# EAGLE design BLMtestpcb (EAGLE 9.4.2)
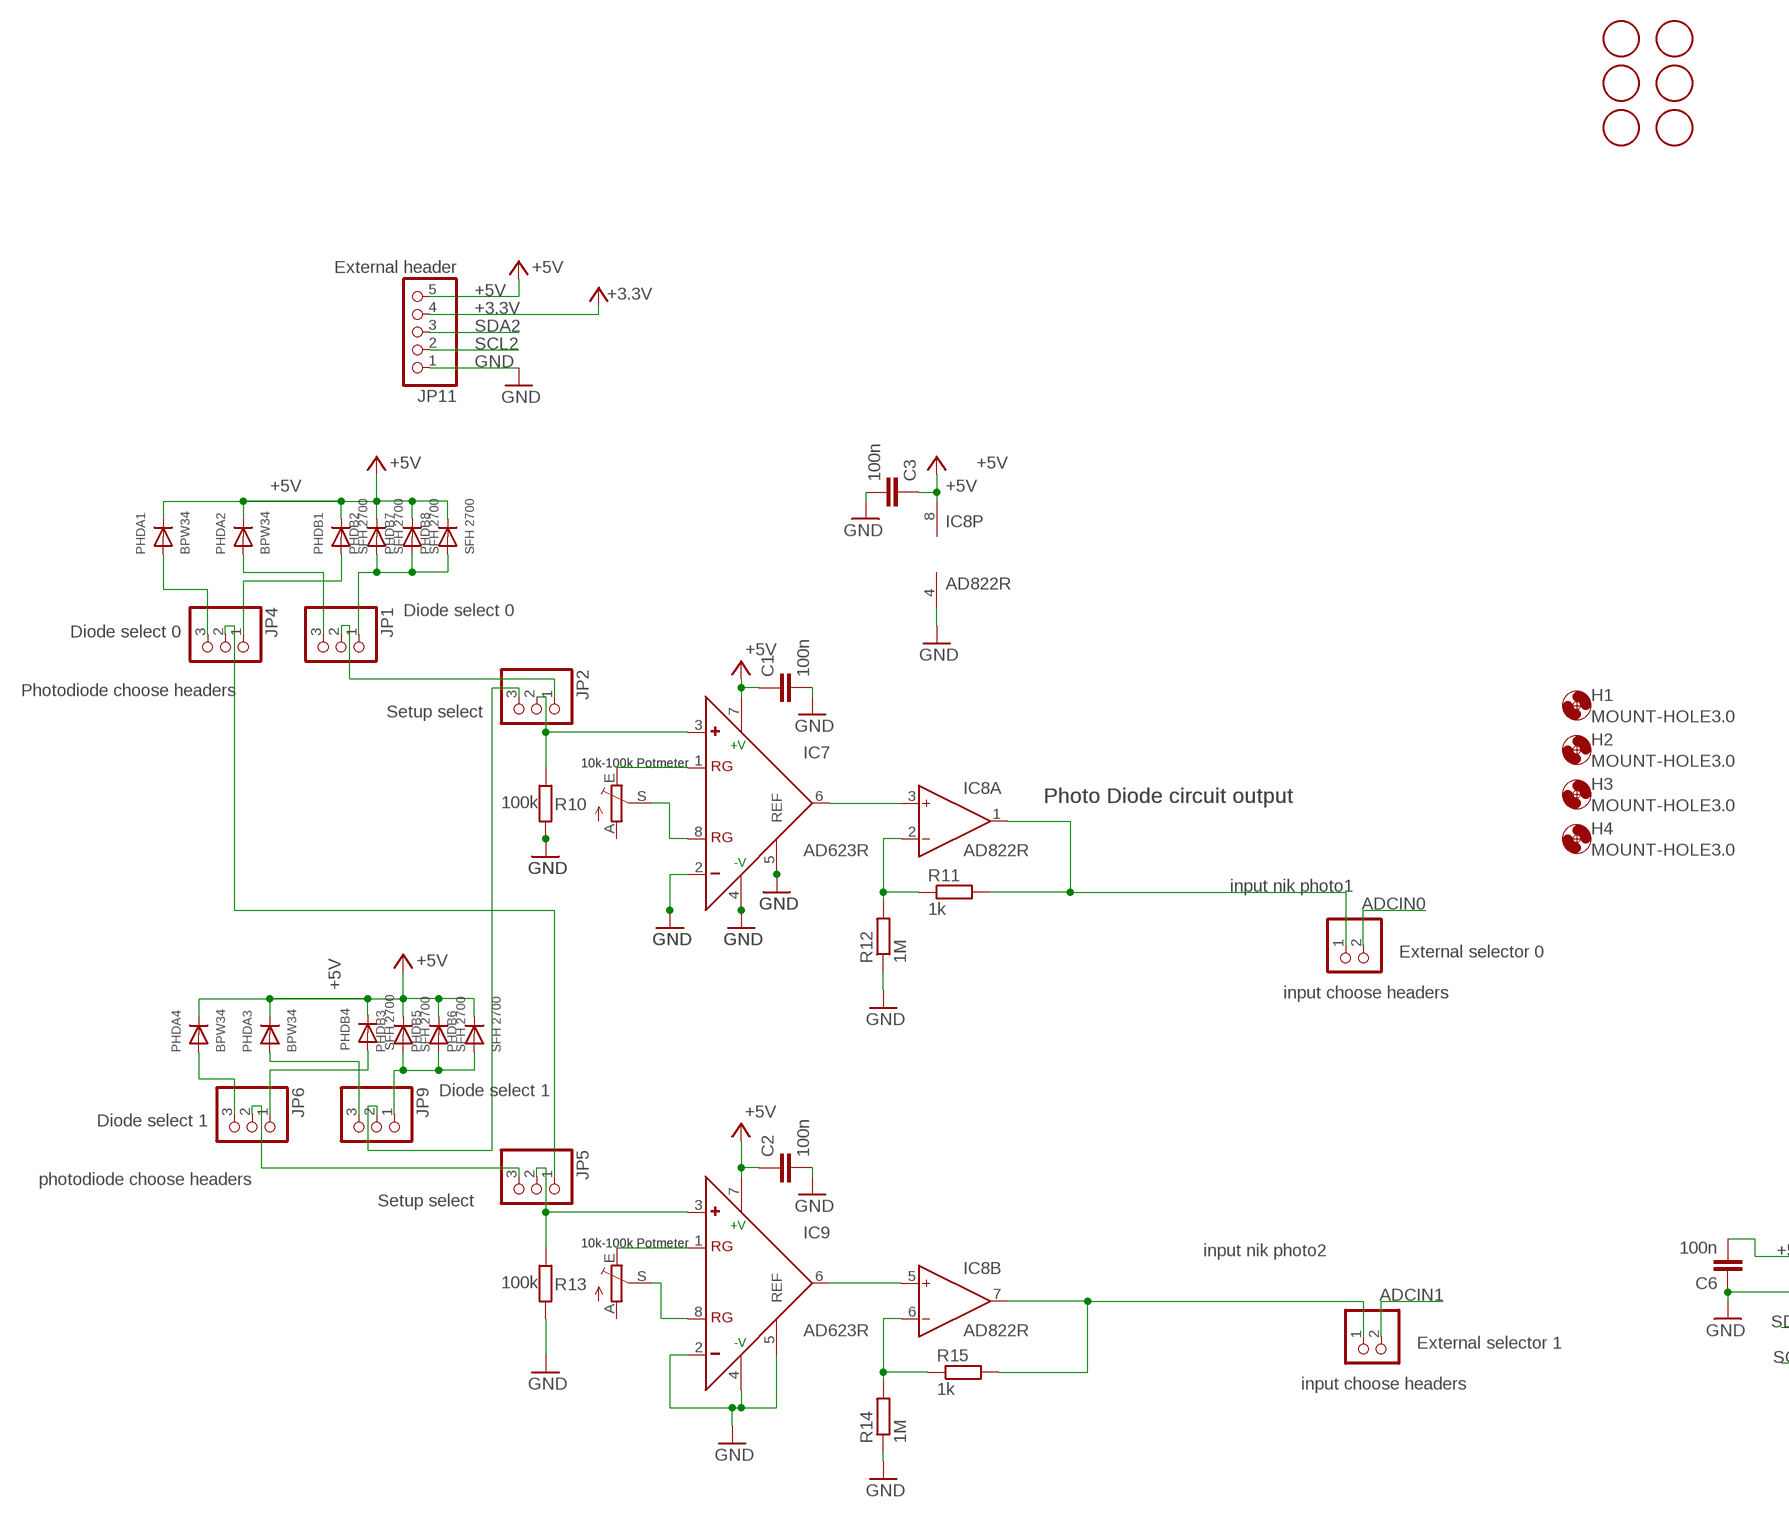
[diagram p0: schematic, sheet 1, part 1 of 2]
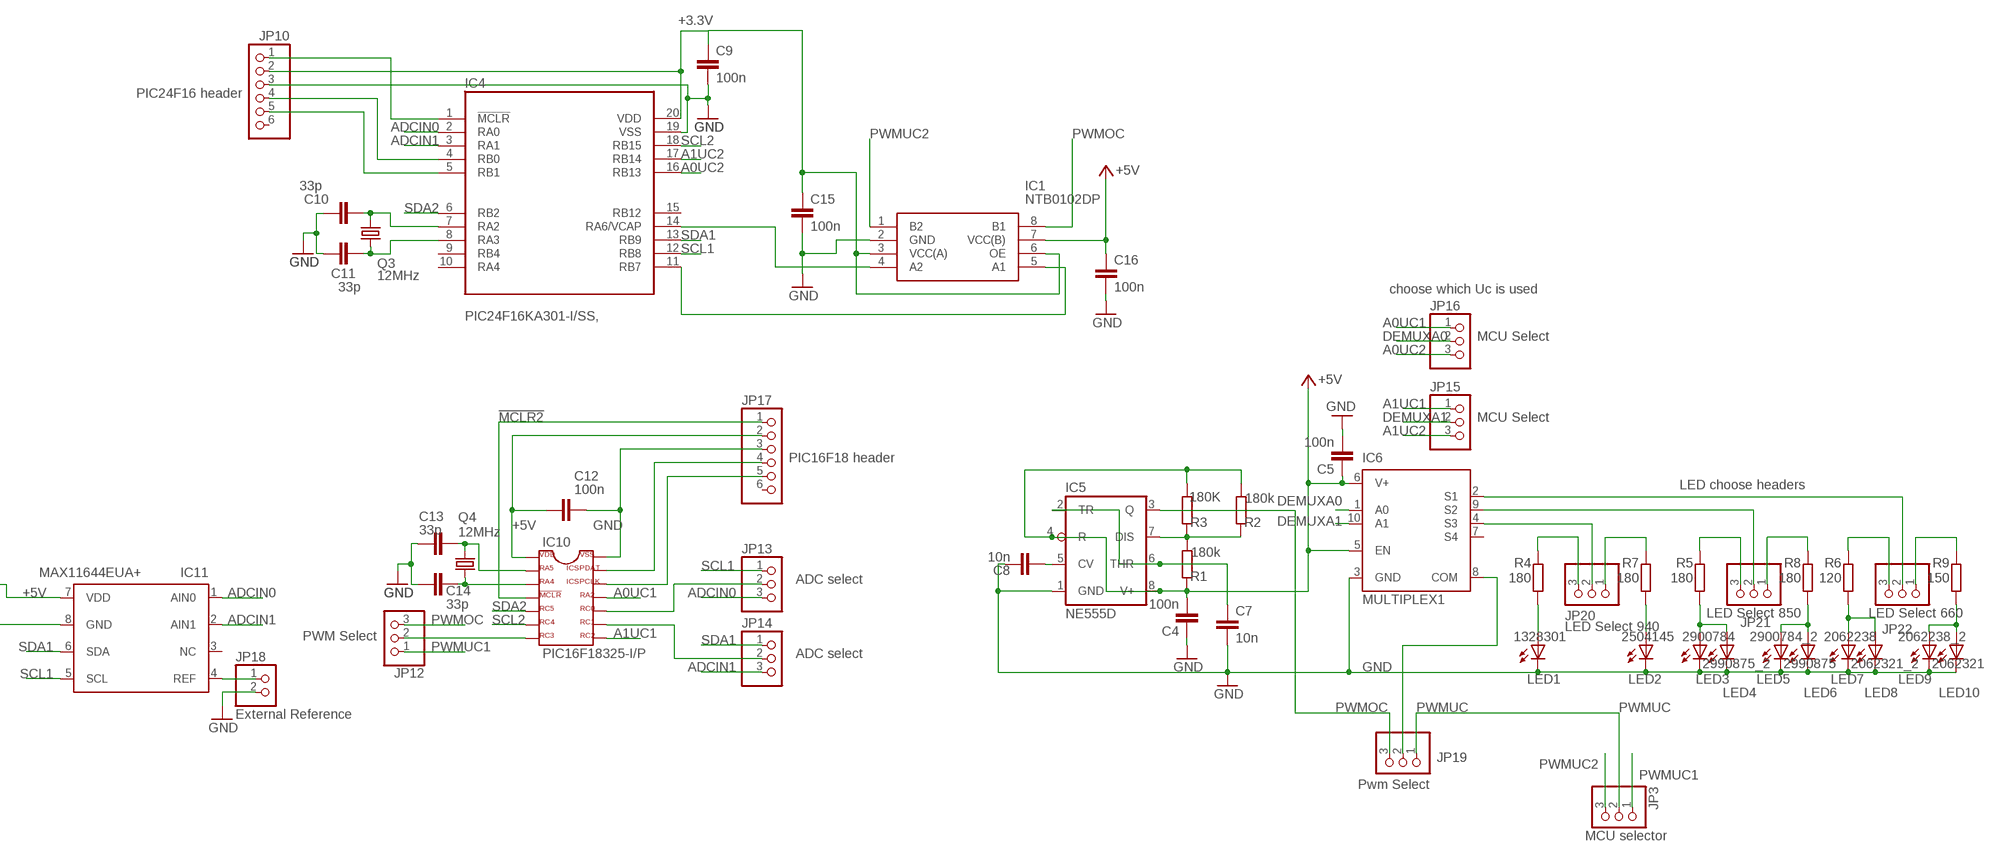
[diagram p1: schematic, sheet 1, part 2 of 2]

## Parts
C1  100n  C-EU025-025X050  [C025-025X050]
C2  100n  C-EU025-025X050  [C025-025X050]
C3  100n  C-EU025-025X050  [C025-025X050]
C4  100n  C-EU025-025X050  [C025-025X050]
C5  100n  C-EU025-025X050  [C025-025X050]
C6  100n  C-EU025-025X050  [C025-025X050]
C7  10n  C-EU025-025X050  [C025-025X050]
C8  10n  C-EU025-025X050  [C025-025X050]
C9  100n  C-EU025-024X044  [C025-024X044]
C10  33p  C-EU025-025X050  [C025-025X050]
C11  33p  C-EU025-025X050  [C025-025X050]
C12  100n  C-EU025-024X044  [C025-024X044]
C13  33p  C-EU025-025X050  [C025-025X050]
C14  33p  C-EU025-025X050  [C025-025X050]
C15  100n  C-EU025-024X044  [C025-024X044]
C16  100n  C-EU025-024X044  [C025-024X044]
H1  MOUNT-HOLE3.0  [3,0]
H2  MOUNT-HOLE3.0  [3,0]
H3  MOUNT-HOLE3.0  [3,0]
H4  MOUNT-HOLE3.0  [3,0]
IC1  NTB0102DP  [SOP65P400X110-8N]
IC4  PIC24F16KA301-I/SS,  PIC24F16KA301-I/SS  [WM8804]
IC5  NE555D  [SO08]
IC6  MULTIPLEX1  [MSOP10]
IC7  AD623R  [SO8]
IC8  AD822R  [SO8]
IC9  AD623R  [SO8]
IC10  PIC16F18325-I/P  [DIL14]
IC11  MAX11644EUA+  [UMAX8]
JP1  Diode select 0  PINHD-1X3  [1X03]
JP2  Setup select  PINHD-1X3  [1X03]
JP3  MCU selector  PINHD-1X3  [1X03]
JP4  Diode select 0  PINHD-1X3  [1X03]
JP5  Setup select  PINHD-1X3  [1X03]
JP6  Diode select 1  PINHD-1X3  [1X03]
JP7  External selector 0  PINHD-1X2  [1X02]
JP8  External selector 1  PINHD-1X2  [1X02]
JP9  Diode select 1  PINHD-1X3  [1X03]
JP10  PIC24F16 header  PINHD-1X6  [1X06]
JP11  External header  PINHD-1X5  [1X05]
JP12  PWM Select  PINHD-1X3  [1X03]
JP13  ADC select  PINHD-1X3  [1X03]
JP14  ADC select  PINHD-1X3  [1X03]
JP15  MCU Select  PINHD-1X3  [1X03]
JP16  MCU Select  PINHD-1X3  [1X03]
JP17  PIC16F18 header  PINHD-1X6  [1X06]
JP18  External Reference  PINHD-1X2  [1X02]
JP19  Pwm Select  PINHD-1X3  [1X03]
JP20  LED Select 940  PINHD-1X3  [1X03]
JP21  LED Select 850  PINHD-1X3  [1X03]
JP22  LED Select 660  PINHD-1X3  [1X03]
LED1  1328301  LEDCHIPLED_1206  [CHIPLED_1206]
LED2  2504145  LEDCHIPLED_1206  [CHIPLED_1206]
LED3  2900784  LEDCHIPLED_0603  [CHIPLED_0603]
LED4  2990875_2  LEDCHIPLED_1206  [CHIPLED_1206]
LED5  2900784_2  LEDCHIPLED_0603  [CHIPLED_0603]
LED6  2990875  LEDCHIPLED_1206  [CHIPLED_1206]
LED7  2062238  LEDCHIPLED_0805  [CHIPLED_0805]
LED8  2062321_2  LEDCHIPLED_1206  [CHIPLED_1206]
LED9  2062238_2  LEDCHIPLED_0805  [CHIPLED_0805]
LED10  2062321  LEDCHIPLED_1206  [CHIPLED_1206]
PHDA1  BPW34  DIODESOT23_WAVE  [SOT23-W]
PHDA2  BPW34  DIODESOT23_WAVE  [SOT23-W]
PHDA3  BPW34  DIODESOT23_WAVE  [SOT23-W]
PHDA4  BPW34  DIODESOT23_WAVE  [SOT23-W]
PHDB1  SFH 2700  DIODE_SOD-123FL  [SOD-123FL]
PHDB2  SFH 2700  DIODE_SOD-123FL  [SOD-123FL]
PHDB3  SFH 2700  DIODE_SOD-123FL  [SOD-123FL]
PHDB4  SFH 2700  DIODE_SOD-123FL  [SOD-123FL]
PHDB5  SFH 2700  DIODE_SOD-123FL  [SOD-123FL]
PHDB6  SFH 2700  DIODE_SOD-123FL  [SOD-123FL]
PHDB7  SFH 2700  DIODE_SOD-123FL  [SOD-123FL]
PHDB8  SFH 2700  DIODE_SOD-123FL  [SOD-123FL]
POTMETER1  10k-100k  TRIM_EU-PT10  [PT-10]
POTMETER2  10k-100k  TRIM_EU-PT10  [PT-10]
Q3  12MHz  CRYSTALHC49U70  [HC49U70]
Q4  12MHz  CRYSTALHC49U70  [HC49U70]
R1  180k  R-EU_0207/10  [0207/10]
R2  180k  R-EU_0207/10  [0207/10]
R3  180K  R-EU_0207/10  [0207/10]
R4  180  R-EU_0207/10  [0207/10]
R5  180  R-EU_0207/10  [0207/10]
R6  120  R-EU_0207/10  [0207/10]
R7  180  R-EU_0207/10  [0207/10]
R8  180  R-EU_0207/10  [0207/10]
R9  150  R-EU_0207/10  [0207/10]
R10  100k  R-EU_0207/10  [0207/10]
R11  1k  R-EU_0207/10  [0207/10]
R12  1M  R-EU_0207/10  [0207/10]
R13  100k  R-EU_0207/10  [0207/10]
R14  1M  R-EU_0207/10  [0207/10]
R15  1k  R-EU_0207/10  [0207/10]
U$1  FIDUCIAL  [FIDUCIAL_1MM]
U$2  FIDUCIAL  [FIDUCIAL_1MM]
U$3  FIDUCIAL  [FIDUCIAL_1MM]
U$4  FIDUCIAL  [FIDUCIAL_1MM]
U$5  FIDUCIAL  [FIDUCIAL_1MM]
U$6  FIDUCIAL  [FIDUCIAL_1MM]

## Nets
660A: JP22.3 R6.2
660B: JP22.1 R9.2
850A: JP21.3 R5.2
850B: JP21.1 R8.2
940A: JP20.3 R4.2
940B: JP20.1 R7.2
!MCLR: IC4.1(!MCLR) JP10.1
!MCLR2: IC10.4(VPP/!MCLR/RA3) JP17.1
+3.3V: C9.1 C15.1 IC1.3(VCC(A)) IC1.6(OE) IC4.20(VDD) JP10.2 JP11.4
+5V: C1.1 C2.1 C3.1 C4.2 C5.1 C6.2 C12.1 IC5.4(R) IC5.8(V+) IC6.5(EN) IC6.6(V+) IC7.7(+V) IC8.8(P:V+) IC9.7(+V) IC10.1(VDD) IC11.7(VDD) JP11.5 JP17.2 PHDA1.3(C) PHDA2.3(C) PHDA3.3(C) PHDA4.3(C) PHDB1.C PHDB2.C PHDB3.C PHDB4.C PHDB5.C PHDB6.C PHDB7.C PHDB8.C R1.1 R2.2 R3.2
A0UC1: IC10.11(RA2) JP16.1
A0UC2: IC4.16(RB13) JP16.3
A1UC1: IC10.8(RC2) JP15.1
A1UC2: IC4.17(RB14) JP15.3
ADCIN0: IC4.2(RA0) IC11.1(AIN0) JP7.2 JP13.3
ADCIN1: IC4.3(RA1) IC11.2(AIN1) JP8.2 JP14.3
BOT0: JP2.3 JP9.2
BOT1: JP5.3 JP6.2
DEMUXA0: IC6.1(A0) JP16.2
DEMUXA1: IC6.10(A1) JP15.2
GND: C1.2 C2.2 C3.2 C4.1 C5.2 C6.1 C7.2 C8.1 C9.2 C10.1 C11.1 C12.2 C13.1 C14.1 C15.2 C16.2 IC1.2(GND) IC4.19(VSS) IC5.1(GND) IC6.3(GND) IC7.2(-) IC7.4(-V) IC7.5(REF) IC8.4(P:V-) IC9.2(-) IC9.4(-V) IC9.5(REF) IC10.14(VSS) IC11.8(GND) JP10.3 JP11.1 JP17.3 JP18.2 LED1.C LED2.C LED3.C LED4.C LED5.C LED6.C LED7.C LED8.C LED9.C LED10.C R10.2 R12.1 R13.2 R14.1
INPUTPHOTO1: IC8.1(A:OUT) JP7.1 R11.2
N$6: IC8.6(B:IN-) R14.2 R15.1
N$7: IC1.4(A2) IC4.14(RA6/VCAP)
N$8: IC1.5(A1) IC4.11(RB7)
N$14: C7.1 IC5.2(TR) IC5.6(THR)
N$15: IC5.7(DIS) R1.2 R2.1 R3.1
N$16: IC6.8(COM) JP19.2
N$17: C8.2 IC5.5(CV)
N$18: LED1.A R4.1
N$19: LED3.A LED4.A R5.1
N$20: LED7.A LED8.A R6.1
N$21: LED2.A R7.1
N$22: LED5.A LED6.A R8.1
N$23: LED9.A LED10.A R9.1
N$24: IC6.2(S1) JP22.2
N$25: IC6.9(S2) JP21.2
N$26: IC6.4(S3) JP20.2
N$33: IC7.1(RG) POTMETER2.E
N$34: IC9.1(RG) POTMETER1.E
N$36: IC7.6(OUT) IC8.3(A:IN+)
N$37: IC8.2(A:IN-) R11.1 R12.2
N$39: IC9.8(RG) POTMETER1.S
N$42: IC8.5(B:IN+) IC9.6(OUT)
N$44: IC8.7(B:OUT) JP8.1 R15.2
N$45: IC7.8(RG) POTMETER2.S
N$50: IC10.13(RA0/ICSPDAT) JP17.4
N$51: IC4.5(RB1) JP10.5
N$52: IC4.4(RB0) JP10.4
N$56: IC10.12(RA1/ICSPCLK) JP17.5
N$57: C10.2 IC4.7(RA2) Q3.2
N$58: C11.2 IC4.8(RA3) Q3.1
N$59: IC10.7(RC3) JP12.2
N$60: C14.2 IC10.3(RA4) Q4.1
N$61: C13.2 IC10.2(RA5) Q4.2
OP-AMP0: IC7.3(+) JP2.2 R10.1
OP-AMP1: IC9.3(+) JP5.2 R13.1
PWMOC: IC1.8(B1) IC5.3(Q) JP12.3 JP19.3
PWMUC: JP3.2 JP19.1
PWMUC1: JP3.1 JP12.1
PWMUC2: IC1.1(B2) JP3.3
RC2: IC10.10(RC0) JP13.2
RC3: IC10.9(RC1) JP14.2
REF: IC11.4(REF) JP18.1
SCL1: IC4.12(RB8) IC11.5(SCL) JP13.1
SCL2: IC4.18(RB15) IC10.6(RC4) JP11.2
SDA1: IC4.13(RB9) IC11.6(SDA) JP14.1
SDA2: IC4.6(RB2) IC10.5(RC5) JP11.3
TOP0: JP1.2 JP2.1
TOP1: JP4.2 JP5.1
TYPE00A: JP4.3 PHDA1.1(A) PHDA1.2(A)
TYPE00B: JP4.1 PHDB1.A
TYPE01A: JP1.3 PHDA2.1(A) PHDA2.2(A)
TYPE01B: JP1.1 PHDB2.A PHDB7.A PHDB8.A
TYPE10A: JP6.3 PHDA4.1(A) PHDA4.2(A)
TYPE10B: JP6.1 PHDB4.A
TYPE11A: JP9.3 PHDA3.1(A) PHDA3.2(A)
TYPE11B: JP9.1 PHDB3.A PHDB5.A PHDB6.A
VCC: C16.1 IC1.7(VCC(B)) ; supply symbol labelled +5V
Unconnected: IC4.9(RB4) IC4.10(RA4) IC4.15(RB12) IC6.7(S4) IC11.3(NC) JP10.6 JP17.6 POTMETER1.A POTMETER2.A

## Notes on the sheet
- Photodiode choose headers
- 10k-100k Potmeter | 10k-100k Potmeter
- Photo Diode circuit output | Photo Diode circuit output
- choose which Uc is used
- input nik photo1
- input choose headers
- LED choose headers
- photodiode choose headers
- 10k-100k Potmeter | 10k-100k Potmeter
- input nik photo2
- input choose headers

## Library data of the parts
C1-C8 C10 C11 C13 C14 = resistor:C-EU: CAPACITOR, European symbol
C9 C12 C15 C16 = rcl:C-EU: CAPACITOR, European symbol; SPICEPREFIX: C
H1-H4 = holes:MOUNT-HOLE: MOUNTING HOLE with drill center marker
IC1 = BloodMonLib:NTB0102DP: NXP NTB0102DP, Voltage Level Translator, 3-State, 1.2 3.6 V, 1.65 5.5 V, 8-Pin TSSOP Source: Datasheet <http://www.nxp.com/documents/data_sheet/NTB0102.pdf>; DESCRIPTION: NXP NTB0102DP, Voltage Level Translator, 3-State, 1.2 3.6 V, 1.65 5.5 V, 8-Pin TSSOP; HEIGHT: 1.1mm; MANUFACTURER_NAME: Nexperia; MANUFACTURER_PART_NUMBER: NTB0102DP; MOUSER_PART_NUMBER: N/A; MOUSER_PRICE-STOCK: https://www.mouser.com/Search/Refine.aspx?Keyword=N%2FA
IC4 = BloodMonLib:PIC24F16KA301-I/SS: S/PDIF TRNSCEIVER by CIrrus Logic/Wolfson
IC5 = linear_custom:*555: TIMER
IC6 = Peerke:MULTIPLEX1: 2-Channel, 12-Bit ADC with I2C-Compatible Interface 10-Lead MSOP Source: http://www.analog.com/UploadedFiles/Data_Sheets/224965274AD7992_0.pdf; MPN: AD7992BRMZ-0; OC_FARNELL: 1078311; OC_NEWARK: 31M4422
IC7 IC9 = analog-devices_custom:AD623: Single-Supply, Rail-to-Rail, Low Cost Instrumentation Amplifier Source: http://www.analog.com/static/imported-files/data_sheets/AD623.pdf; MPN: AD623ARZ.; OC_FARNELL: 9426213; OC_NEWARK: 31M4186
IC8 = analog-devices_custom:AD822: Single-Supply, Rail-to-Rail Low Power FET-Input Op Amp Source: http://www.analog.com/static/imported-files/data_sheets/AD822.pdf; MF: ANALOG DEVICES; MPN: AD822BRZ; OC_FARNELL: 1651303
IC10 = BloodMonLib:PIC16F18325-I/P: Dual In Line / Socket
IC11 = BloodMonLib:MAX11644EUA+: DC/DC CONVERTER; MF: MAXIM; MPN: MAX1674EUA+; OC_FARNELL: 1379864; OC_NEWARK: 23K5719
JP1-JP6 JP9 JP12-JP16 JP19-JP22 = pinhead:PINHD-1X3: PIN HEADER
JP7 JP8 JP18 = pinhead:PINHD-1X2: PIN HEADER
JP10 JP17 = pinhead:PINHD-1X6: PIN HEADER
JP11 = pinhead:PINHD-1X5: PIN HEADER
LED1-LED10 = adafruit:LED: LED OSRAM: - CHIPLED LG R971, LG N971, LY N971, LG Q971, LY Q971, LO R971, LY R971 LH N974, LH R974 LS Q976, LO Q976, LY Q976 LO Q996 - Hyper CHIPLED LW Q18S LB Q993, LB Q99A, LB R99A - SideLED LS A670, LO A670, LY A670, LG A670, LP A670 LB A673, LV A673, LT A673, LW A673 LH A674 LY A675 LS A676, LA A676, LO A676, LY A676, LW A676 LS A679, LY A679, LG A679 - Hyper Micro SIDELED® LS Y876, LA Y876, LO Y876, LY Y876 LT Y87S - SmartLED LW L88C, LW L88S LB L89C, LB L89S, LG L890 LS L89K, LO L89K, LY L89K LS L896, LA L896, LO L896, LY L896 - TOPLED LS T670, LO T670, LY T670, LG T670, LP T670 LSG T670, LSP T670, LSY T670, LOP T670, LYG T670 LG T671, LOG T671, LSG T671 LB T673, LV T673, LT T673, LW T673 LH T674 LS T676, LA T676, LO T676, LY T676, LB T676, LH T676, LSB T676, LW T676 LB T67C, LV T67C, LT T67C, LS T67K, LO T67K, LY T67K, LW E67C LS E67B, LA E67B, LO E67B, LY E67B, LB E67C, LV E67C, LT E67C LW T67C LS T679, LY T679, LG T679 LS T770, LO T770, LY T770, LG T770, LP T770 LB T773, LV T773, LT T773, LW T773 LH T774 LS E675, LA E675, LY E675, LS T675 LS T776, LA T776, LO T776, LY T776, LB T776 LHGB T686 LT T68C, LB T68C - Hyper Mini TOPLED® LB M676 - Mini TOPLED Santana® LG M470 LS M47K, LO M47K, LY M47K Source: http://www.osram.convergy.de/
PHDA1-PHDA4 PHDB1-PHDB8 = adafruit:DIODE: Diode SMADIODE - SMA Surface Mount Package 20V 1A Schottky Diode Digikey: 641-1014-6-ND DO-1N4148 - Through Hole Small Current Diode SOD-123 20V 1 A (.5mV Vf) Schottky Diode - Digikey: MBRX120TPMSCT-ND SOD-323 10V 570mA (.38mV Vf, 3ns) Schottky Diode - Digikey: ZLLS410CT-ND SOD-523 30V 30mA Schottky Diode (RB751S-40TE61) - Digikey: RB751S-40TE61CT-ND SOT23-R/W - SOT23 Package (R = Solder Paste/Reflow Ovens, W = Hand-Soldering) BAT54Film 40V 300mA - Digikey: 497-7162-1-ND
POTMETER1 POTMETER2 = pot:TRIM_EU-: POTENTIOMETER
Q3 Q4 = crystal:CRYSTAL: CRYSTAL; OC_FARNELL: unknown; OC_NEWARK: unknown
R1-R3 R6 R9 = resistor:R-EU_: RESISTOR, European symbol
R4 R5 R7 R8 R10-R15 = rcl:R-EU_: RESISTOR, European symbol; SPICEPREFIX: R
U$1-U$6 = adafruit:FIDUCIAL: For use by pick and place machines to calibrate the vision/machine, 1mm By microbuilder.eu

## Board
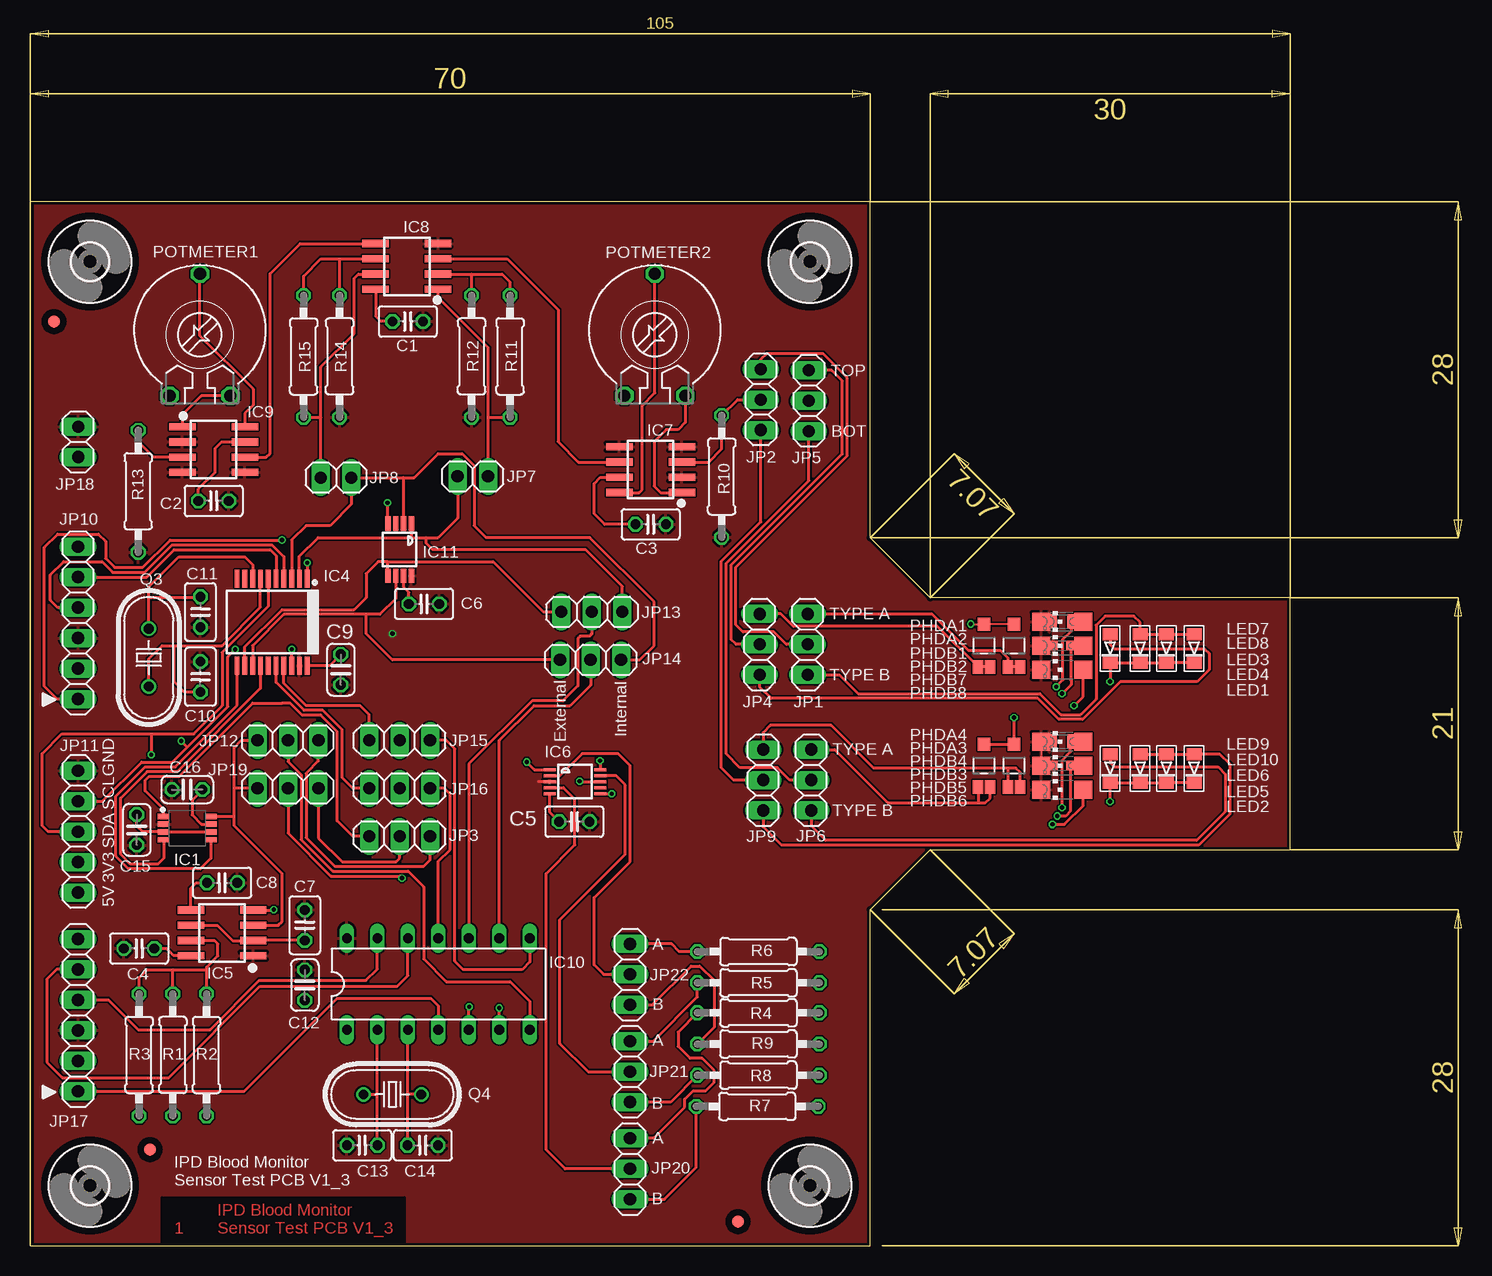
[diagram p2: board, top side]
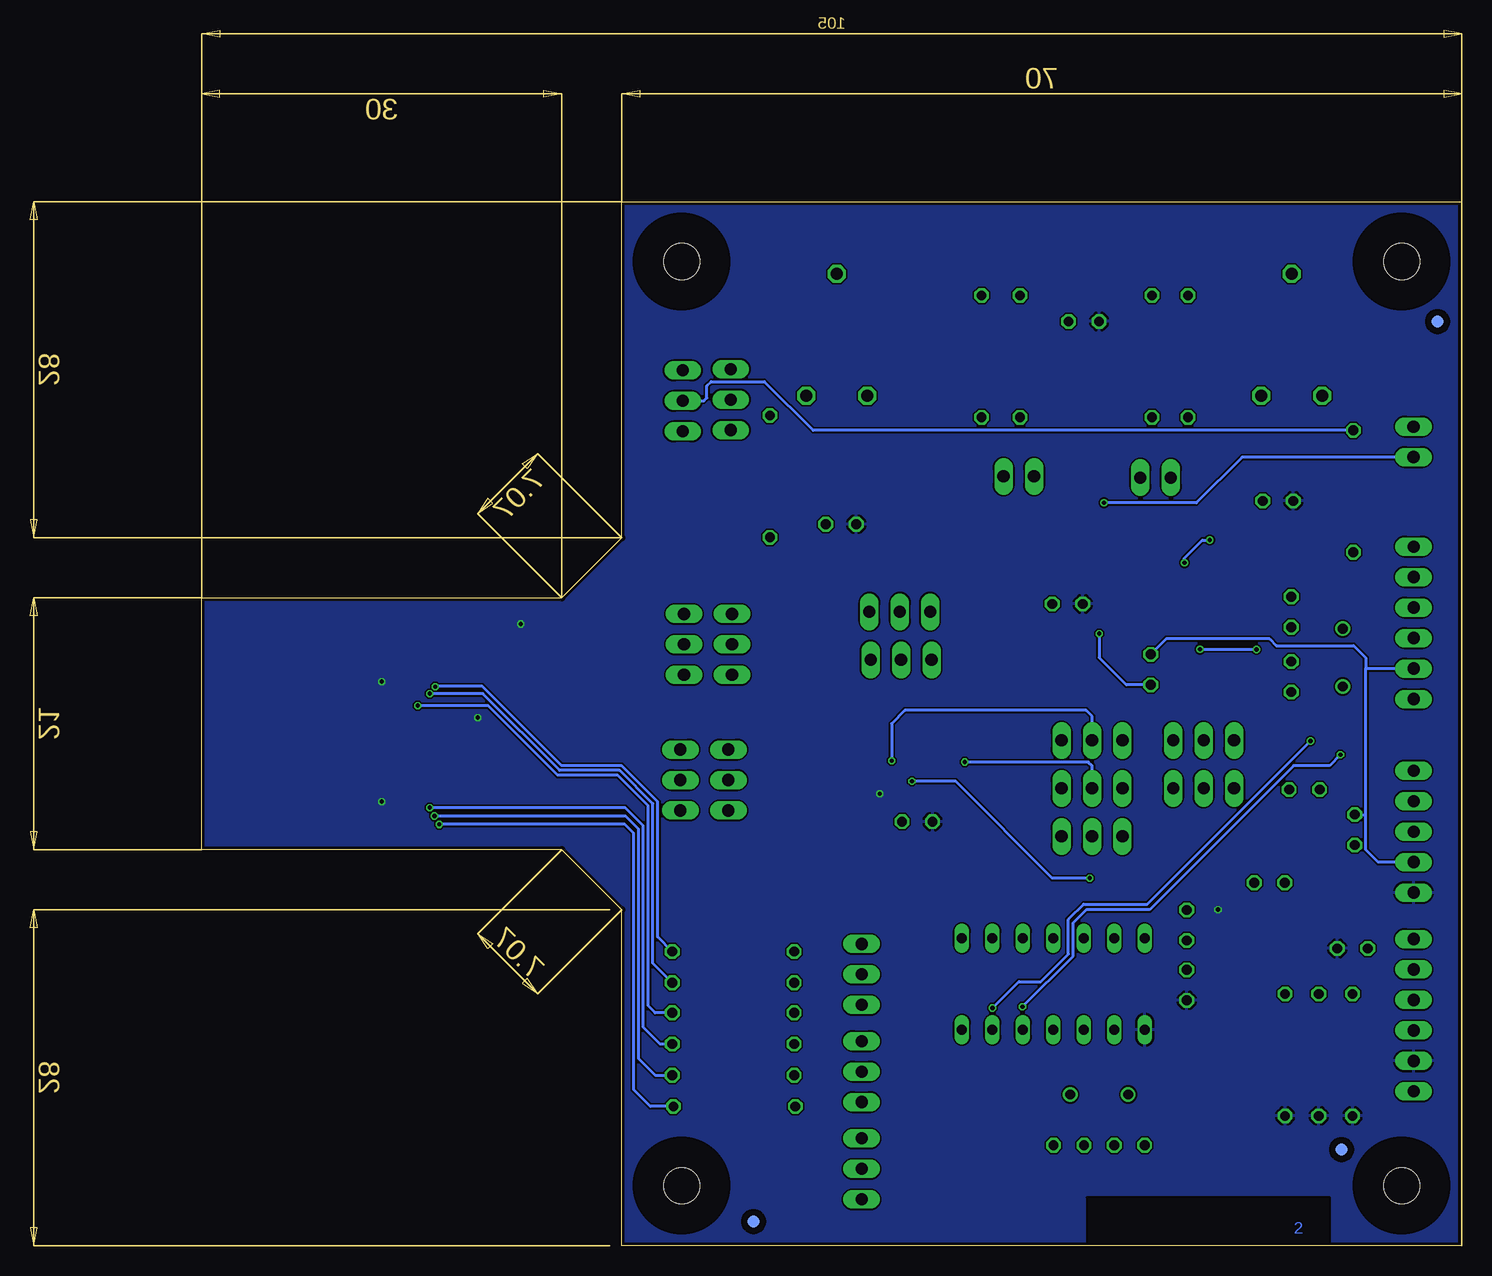
[diagram p3: board, bottom side, seen from below]

Size 105 x 87 mm. Coordinates in mm from the lower left corner, seen from the top.
Outline: 0,0 70,0 70,28 75,33 105,33 105,54 75,54 70,59 70,87 0,87 0,0
Copper layers (1*16): Top 0.018mm / dielectric 1.55mm / Bottom 0.018mm
Design rules "eC_2Layer_PClass6_BaseCopperO18_eCDefault *": minimum track width 0.15mm, minimum drill 0.35mm, track to track 0.15mm, track to pad 0.15mm, pad to pad 0.15mm, via to via 0.15mm, smd to smd 0mil, copper to edge 0.25mm, drill to drill 0.35mm, minimum pad ring 0.175mm, minimum via ring 0.125mm, stop-mask expansion 0mil, vias tented up to drill 0.45mm, thermal gap 0.2mm

### Footprints (pad centres in the part's own frame; a part is rotated, then mirrored left to right if it is on the bottom)
C025-025X050 = drill 0.813 octagon: 1 -1.27,0; 2 1.27,0
C025-024X044 = drill 0.813 octagon: 1 -1.27,0; 2 1.27,0
3,0 = hole 3: 0,0
SOP65P400X110-8N = smd 0.95 x 0.45: 1 -1.975,0.975; 2 -1.975,0.325; 3 -1.975,-0.325; 4 -1.975,-0.975; 5 1.975,-0.975; 6 1.975,-0.325; 7 1.975,0.325; 8 1.975,0.975
WM8804 = smd 0.4 x 1.5: 1 1.393,-1.085; 2 2.043,-1.085; 3 2.693,-1.085; 4 3.343,-1.085; 5 3.993,-1.085; 6 4.643,-1.085; 7 5.293,-1.085; 8 5.943,-1.085; 9 6.593,-1.085; 10 7.243,-1.085; 11 7.243,6.165; 12 6.593,6.165; 13 5.943,6.165; 14 5.293,6.165; 15 4.643,6.165; 16 3.993,6.165; 17 3.343,6.165; 18 2.693,6.165; 19 2.043,6.165; 20 1.393,6.165
SO08 = smd 0.6 x 2.2: 1 -1.905,-2.6; 2 -0.635,-2.6; 3 0.635,-2.6; 4 1.905,-2.6; 5 1.905,2.6; 6 0.635,2.6; 7 -0.635,2.6; 8 -1.905,2.6
MSOP10 = smd 0.25 x 1: 1 -1,-2.113; 2 -0.5,-2.113; 3 0,-2.113; 4 0.5,-2.113; 5 1,-2.113; 6 1,2.113; 7 0.5,2.113; 8 0,2.113; 9 -0.5,2.113; 10 -1,2.113
SO8 = smd 0.6 x 2.2: 1 -1.905,-2.6; 2 -0.635,-2.6; 3 0.635,-2.6; 4 1.905,-2.6; 5 1.905,2.6; 6 0.635,2.6; 7 -0.635,2.6; 8 -1.905,2.6
DIL14 = drill 0.813 long: 1 -7.62,-3.81; 2 -5.08,-3.81; 3 -2.54,-3.81; 4 0,-3.81; 5 2.54,-3.81; 6 5.08,-3.81; 7 7.62,-3.81; 8 7.62,3.81; 9 5.08,3.81; 10 2.54,3.81; 11 0,3.81; 12 -2.54,3.81; 13 -5.08,3.81; 14 -7.62,3.81
UMAX8 = smd 0.45 x 1.2: 1 -0.975,-2.175; 2 -0.325,-2.175; 3 0.325,-2.175; 4 0.975,-2.175; 5 0.975,2.175; 6 0.325,2.175; 7 -0.325,2.175; 8 -0.975,2.175
1X03 = drill 1.016 long: 1 -2.54,0; 2 0,0; 3 2.54,0
1X02 = drill 1.016 long: 1 -1.27,0; 2 1.27,0
1X06 = drill 1.016 long: 1 -6.35,0; 2 -3.81,0; 3 -1.27,0; 4 1.27,0; 5 3.81,0; 6 6.35,0
1X05 = drill 1.016 long: 1 -5.08,0; 2 -2.54,0; 3 0,0; 4 2.54,0; 5 5.08,0
CHIPLED_1206 = smd 1.5 x 1.5: A 0,-1.75; C 0,1.75
CHIPLED_0603 = smd 0.8 x 0.8: A 0,-0.75; C 0,0.75
CHIPLED_0805 = smd 1.2 x 1.2: A 0,-1.05; C 0,1.05
SOT23-W = smd 0.88 x 1.1: 1 -0.5,-1.78; 2 0.5,-1.78 | smd 1.02 x 1.1: 3 0,1.78
SOD-123FL = smd 1 x 1.25: A 0.938,0; C -1.438,0
PT-10 = drill 1.016 octagon: A -2.54,-5.08; E 2.54,-5.08; S 0,5.08
HC49U70 = drill 0.813: 1 -2.413,0; 2 2.413,0
0207/10 = drill 0.813 octagon: 1 -5.08,0; 2 5.08,0
FIDUCIAL_1MM = smd 1 x 1: 1 0,0

### Placement (x,y rotation side)
C1  31.48,77.01 0 top
C2  15.3,62.06 0 top
C3  51.72,60.11 0 top
C4  9.09,24.76 0 top
C5  45.36,35.33 0 top
C6  32.84,53.47 180 top
C7  22.9,26.7 90 top
C8  16.01,30.23 180 top
C9  25.9,48 270 top
C10  14.2,47.4 270 top
C11  14.2,52.8 90 top
C12  22.9,21.71 90 top
C13  27.68,8.36 0 top
C14  32.73,8.36 180 top
C15  8.9,34.65 270 top
C16  13.1,38 180 top
H1  5,5 0 top
H2  65,5 0 top
H3  5,82 0 top
H4  65,82 0 top
IC1  13.1,34.8 0 top
IC4  24.5,54.5 180 top
IC5  16,26.06 90 top
IC6  45.42,38.66 270 top
IC7  51.72,64.66 90 top
IC8  31.4,81.6 90 top
IC9  15.3,66.34 270 top
IC10  34.03,21.8 0 top
IC11  30.8,58 180 top
JP1  64.8,50.1 90 top
JP2  60.9,70.5 270 top
JP3  30.8,34.1 180 top
JP4  60.8,50.1 90 top
JP5  64.9,70.4 270 top
JP6  65.1,38.8 90 top
JP7  36.9,64.1 180 top
JP8  25.5,64 0 top
JP9  61.1,38.8 90 top
JP10  4,51.9 90 top
JP11  4,34.5 270 top
JP12  21.5,42.1 180 top
JP13  46.82,52.81 0 top
JP14  46.71,48.81 0 top
JP15  30.8,42.1 180 top
JP16  30.8,38.1 180 top
JP17  4,19.2 90 top
JP18  4.01,66.98 90 top
JP19  21.5,38.1 180 top
JP20  50,6.4 90 top
JP21  50,14.5 90 top
JP22  50,22.6 90 top
LED1  86,48 90 top
LED2  86,38 90 top
LED3  86,50 90 top
LED4  86,50 90 top
LED5  86,40 90 top
LED6  86,40 90 top
LED7  86,52 90 top
LED8  86,52 90 top
LED9  86,42 90 top
LED10  86,42 90 top
PHDA1  79.5,50 0 top
PHDA2  82,50 0 top
PHDA3  82,40 0 top
PHDA4  79.5,40 0 top
PHDB1  90,50 90 top
PHDB2  92.5,50 90 top
PHDB3  92.5,40 90 top
PHDB4  90,40 90 top
PHDB5  94.7,40 90 top
PHDB6  97,40 90 top
PHDB7  94.7,50 90 top
PHDB8  97,50 90 top
POTMETER1  14.16,75.9 0 top
POTMETER2  52.07,75.9 0 top
Q3  9.9,49 270 top
Q4  30.2,12.6 180 top
R1  11.9,15.89 90 top
R2  14.71,15.89 270 top
R3  9.09,15.89 270 top
R4  60.7,19.4 180 top
R5  60.7,21.9 180 top
R6  60.7,24.5 180 top
R7  60.6,11.6 180 top
R8  60.7,14.2 180 top
R9  60.7,16.8 180 top
R10  57.64,64.1 270 top
R11  40,74.1 270 top
R12  36.8,74.1 90 top
R13  9.02,62.86 270 top
R14  25.8,74.1 90 top
R15  22.8,74.1 270 top
U$1  10,8 0 top
U$2  59,2 0 top
U$3  2,77 0 top
U$4  10,8 0 bottom
U$5  59,2 0 bottom
U$6  2,77 0 bottom

### Tracks (layer width: path | path; a pad name or v marks a point on that pad's centre or on a via)
660A
  Top 0.25: R6.2 54.1,24.5 53.46,25.14 JP22.3
660B
  Top 0.25: R9.2 57,18.18 57,22.1 55.8,23.3 55.1,23.3 51.86,20.06 JP22.1
850A
  Top 0.25: JP21.3 51.94,17.04 55.62,20.72 R5.2
850B
  Top 0.25: R8.2 53.38,11.96 JP21.1
940A
  Top 0.25: R4.2 54,17.78 54,16.6 55,15.6 56,15.6 57,14.6 57,13.6 56.3,12.9 55.25,12.9 54.55,12.2 54.55,11.55 52,9 51.4,9 50.06,9 JP20.3
940B
  Top 0.25: JP20.1 52.86,3.86 55.52,6.52 R7.2
!MCLR  (via drill 0.35)
  Top 0.25: JP10.1 2.25,45.55 1.2,46.6 1.2,58.18 2.31,59.29 5.69,59.29 6.3,58.68 6.3,57.27 7.06,56.51 9.38,56.51 11.67,58.8 v21,58.8 | v23.1,56.9 IC4.1
  Bottom 0.25: v23.1,56.9 23.1,57.3 21.6,58.8 v21,58.8
!MCLR2
  Top 0.25: IC10.4 34.03,19.97 33.4,20.6 25.6,20.6 17.85,12.85 JP17.1
+3.3V
  Top 0.25: IC4.20 24.96,48.34 C9.1 | IC1.6 IC1.3 9.38,34.48 8.9,34.95 C15.1
  Bottom 0.25: C9.1 24.61,50.55 16,50.55 15.45,50 9,50 8,49 8,48.09 | 8,35.9 8,33 6.96,31.96 JP11.4 | 8,35.9 8,48.09 | JP10.2 8,48.09 | C15.1 8.02,35.92 8,35.9
+5V  (via drill 0.35)
  Top 0.15: 79.5,41.8 PHDA4.3 | PHDB1.C 90,48.7
  Top 0.152: v78.4,51.8 79.48,51.8 PHDA1.3 PHDA2.3
  Top 0.25: IC8.8 28.8,77.45 29.24,77.01 C1.1 | IC9.7 15.97,66.97 15.43,66.43 15.43,64.46 14.03,63.06 C2.1 | C6.2 31.57,54.43 31.12,54.88 IC11.7 | IC6.6 v48.48,37.66 | C5.1 43.31,36.11 IC6.5 | IC5.8 11.97,24.16 11.36,24.76 C4.2 | v20.3,28 20.27,27.96 IC5.4 | C3.1 47.89,60.11 47,61 47,63.5 47.52,64.03 IC7.7 | v90,47 PHDB1.C PHDB2.C PHDB7.C PHDB8.C | PHDB6.C PHDB5.C PHDB3.C PHDB4.C v90,37 | PHDA4.3 79.52,41.8 81.98,41.8 PHDA3.3 v82,44
  pour Bottom: 0,87 105,87 105,0 0,0
A0UC1
  Top 0.25: IC10.11 34.03,32.03 35,33 35,37.6 34.5,38.1 JP16.1
A0UC2
  Top 0.25: JP16.3 26.9,38.1 26,39 26,43 24.4,44.6 22.83,44.6 20.51,46.93 IC4.16
A1UC1
  Top 0.25: IC10.8 41.65,23.65 41,23 36.1,23 35.4,23.7 35.4,41.4 34.7,42.1 JP15.1
A1UC2
  Top 0.25: JP15.3 28.26,44.24 27.5,45 23,45 21.16,46.84 IC4.17
ADCIN0
  Top 0.25: IC4.2 22.46,57.46 24,59 31.7,59 | 31.7,59 33,59 | 33,59 34,59 35.63,60.63 JP7.2 | IC11.1 31.77,59.08 31.7,59 | 33,59 33,58.55 33.55,58 46.3,58 49.36,54.94 JP13.3
ADCIN1
  Top 0.25: 31.1,64 JP8.2 26.77,61.77 25,60 23,60 21.81,58.81 IC4.3 | 31.1,64 32,64 34,66 36,66 37,65 37,60 38,59 46.65,59 52,53.65 52,50 50.81,48.81 JP14.3 | IC11.2 31.12,63.98 31.1,64
BOT0
  Top 0.25: JP9.2 58.63,38.8 57.6,39.83 57.6,57.02 60.9,60.32 JP2.3
BOT1
  Top 0.25: JP6.2 63.33,38.8 62.29,39.84 59.16,39.84 58,41 58,56.85 64.9,63.75 JP5.3
DEMUXA0  (via drill 0.35)
  Top 0.25: v41.4,40.3 42.04,39.66 IC6.1
  Bottom 0.25: JP16.2 30.8,40 31.1,40.3 v41.4,40.3
DEMUXA1  (via drill 0.35)
  Top 0.25: v47.5,40.4 47.53,40.37 IC6.10
  Bottom 0.25: JP15.2 30.8,44.1 31.3,44.6 46.4,44.6 47.5,43.5 v47.5,40.4
GND  (via drill 0.35)
  Top 0.152: LED10.C LED6.C
  Top 0.25: IC6.3 42.36,38.66
  Bottom 0.25: C9.2 27.93,46.73 30.2,49 v30.2,51
  pour Top: 0,87 0,0 105,0 105,87
  cutout Bottom: 11,0 11,4 31.2,4 31.2,0
  cutout Top: 11,0 11,4 31.2,4 31.2,0
INPUTPHOTO1
  Top 0.25: IC8.1 34,79 38.17,74.83 38.17,69 | JP7.1 38.17,69 | R11.2 39.98,69 38.17,69
N$6
  Top 0.25: R15.1 22.8,80.8 24.23,82.23 25.8,82.23 | 25.8,82.23 IC8.6 | R14.2 25.8,82.23
N$7
  Top 0.25: IC4.14 19.21,46.43 12.28,39.5 9.77,39.5 7.55,37.28 7.55,32.62 8.37,31.8 10.65,31.8 11.12,32.27 IC1.4
N$8
  Top 0.25: IC1.5 15.07,32.27 14.2,31.4 8.2,31.4 7.15,32.45 7.15,37.45 9.6,39.9 12.12,39.9 17.26,45.04 IC4.11
N$14
  Top 0.25: IC5.6 15.61,26.7 16.88,25.43 IC5.2 C7.1
N$15
  Top 0.25: R1.2 11.9,23 | R3.1 9.09,22.34 9.75,23 11.9,23 | IC5.7 15.38,25.43 15.65,25.15 15.65,24.15 14.71,23.21 14.71,23 | R2.1 14.71,23 | 11.9,23 14.71,23
N$16  (via drill 0.35)
  Top 0.25: v31,30.62 30.82,30.8 25.07,30.8 21.5,34.37 JP19.2 | v45.8,38.7 45.8,38.66 IC6.8
  Bottom 0.25: v31,30.62 34.1,30.62 42.17,38.7 v45.8,38.7
N$17
  Top 0.25: IC5.5 13.4,29.8 13.84,30.23 C8.2
N$18  (via drill 0.35)
  Top 0.25: v87,45 87.75,45.75 LED1.A
  Bottom 0.25: R4.1 67.2,19.4 67.8,20 67.8,36.67 70.33,39.2 75.33,39.2 81.13,45 v87,45
N$19  (via drill 0.35)
  Top 0.25: v86,46 86.75,46.75 86.75,47.11 86.72,47.14 86.72,49.98 LED3.A LED4.A
  Bottom 0.25: R5.1 67.4,23.52 67.4,36.83 70.17,39.6 75.17,39.6 81.57,46 v86,46
N$20  (via drill 0.35)
  Top 0.15: LED8.A LED7.A
  Top 0.25: v85.52,46.58 86.08,47.14 86.08,50.51 86.75,51.19 86.75,51.7 LED7.A
  Bottom 0.25: R6.1 67,25.72 67,37 70,40 75,40 81.6,46.6 85.5,46.6 v85.52,46.58
N$21  (via drill 0.35)
  Top 0.25: v85.2,35.1 86.2,35.1 87.75,36.65 LED2.A
  Bottom 0.25: R7.1 67.6,11.6 69,13 69,34.37 69.73,35.1 v85.2,35.1
N$22  (via drill 0.35)
  Top 0.15: LED6.A LED5.A
  Top 0.25: LED5.A 86.72,39.98 86.72,36.23 86.3,35.8 v85.6,35.8
  Bottom 0.25: v85.6,35.8 69.67,35.8 68.6,34.73 68.6,15.6 67.2,14.2 R8.1
N$23  (via drill 0.35)
  Top 0.15: 87.15,42.1 87.75,42.1 LED10.A | 87.15,42.1 86.7,42.1 | 87.15,42.1 LED9.A
  Top 0.25: v86,36.5 86,40.44 86.7,41.14 86.7,42.1
  Bottom 0.25: R9.1 66.8,16.8 68.2,18.2 68.2,35 69.7,36.5 v86,36.5
N$24
  Top 0.25: IC6.2 44.16,39.16 46,41 49,41 50,40 50,32 47,29 47,23.4 47.8,22.6 JP22.2
N$25
  Top 0.25: JP21.2 46.5,14.5 44.16,16.84 44.16,27.16 49.6,32.6 49.6,38.4 48.84,39.16 IC6.9
N$26
  Top 0.25: IC6.4 44.44,38.16 45.4,37.2 45.4,33.4 43,31 43,8 44.6,6.4 JP20.2
N$33
  Top 0.25: POTMETER2.E 54.61,68.61 54,68 53,68 52,67 52,63.3 52.55,62.76 IC7.1
N$34
  Top 0.25: POTMETER1.E 14.28,70.82 12.7,69.25 IC9.1
N$36
  Top 0.25: IC8.3 39.77,82.23 44,78 44,67 45.7,65.3 IC7.6
N$37
  Top 0.25: IC8.2 36.8,80.97 | 36.8,80.97 39.34,80.97 40,80.3 R11.1 | R12.2 36.8,80.97
N$39
  Top 0.25: IC9.8 17.9,69.34 18.6,70.05 18.6,71.4 14.16,75.84 POTMETER1.S
N$42
  Top 0.25: IC9.6 19.7,65.7 20,66 20,81 22.5,83.5 IC8.5
N$44
  Top 0.25: IC8.7 27.36,80.97 27,80.6 27,76 24.23,73.23 24.23,69 | JP8.1 24.23,69 | R15.2 24.21,69.02 24.23,69
N$45
  Top 0.25: IC7.8 50.76,62.76 51,63 51,70 52.07,71.07 POTMETER2.S
N$50
  Top 0.25: IC10.13 28.95,23.05 28,22.09 19.09,22.09 15,18 9,18 6.53,20.47 JP17.4
N$51
  Top 0.25: JP10.5 9.71,55.71 12,58 20,58 20.51,57.49 IC4.5
N$52
  Top 0.25: JP10.4 2.33,53.17 1.7,53.8 1.7,55.9 2.8,57 6,57 6.89,56.11 9.54,56.11 11.83,58.4 20.17,58.4 21.16,57.41 IC4.4
N$56
  Top 0.25: IC10.12 31.49,22.49 30.6,21.6 19.17,21.6 11.57,14 2.7,14 1.4,15.3 1.4,22.2 2.21,23.01 JP17.5
N$57
  Top 0.25: Q3.2 9.9,48.9 11,50 12,50 | IC4.7 19.21,53.21 16,50 12,50 | C10.2 12.87,46.13 12,47 12,50
N$58
  Top 0.25: Q3.1 9.9,54 | 9.9,54 9.9,54.9 12.4,57.4 17.9,57.4 18.56,56.74 IC4.8 | C11.2 14.13,54 9.9,54
N$59
  Top 0.25: JP12.2 21.5,40.33 22.6,39.23 22.6,33.83 25.23,31.2 31.5,31.2 32.8,29.9 32.8,23.9 34.7,22 40,22 41.65,20.35 IC10.7
N$60
  Top 0.25: C14.2 31.46,12.6 | 31.46,12.6 31.46,17.96 IC10.3 | Q4.1 31.46,12.6
N$61
  Top 0.25: C13.2 28.95,12.6 | 28.95,12.6 IC10.2 | Q4.2 28.95,12.6
OP-AMP0
  Top 0.25: IC7.3 56.55,65.3 57.64,66.39 R10.1 58.96,70.5 JP2.2
OP-AMP1
  Top 0.25: IC9.3 10.29,65.7 9.02,66.98 R13.1
  Bottom 0.25: R13.1 54.04,67.94 58.1,72 62.55,72 62.9,71.65 62.9,70.65 63.15,70.4 JP5.2
PWMOC
  Top 0.25: IC5.3 20.7,26.7 21,27 21,31 17,35 17,35.8 | 17,35.8 17,38.1 | 17,38.1 17,41.5 17.6,42.1 JP12.3 | JP19.3 17,38.1 | IC1.8 16.98,35.77 17,35.8
PWMUC
  Top 0.25: JP19.1 24.04,33.96 26,32 30.5,32 30.8,32.3 JP3.2
PWMUC1
  Top 0.25: JP12.1 24.04,40.4 23,39.36 23,34 25.4,31.6 32.8,31.6 33.34,32.14 JP3.1
PWMUC2
  Top 0.25: JP3.3 26.9,34.1 25.6,35.4 25.6,42.83 24.23,44.2 22.67,44.2 21.67,45.2 21.23,45.2 21,45.2 18.55,45.2 12.45,39.1 9.93,39.1 9.6,38.77 9.6,37.9 11.12,36.38 IC1.1
RC2
  Top 0.25: IC10.10 36.57,40.14 41.83,45.4 44.4,45.4 45.65,46.65 45.65,50.6 45.85,50.8 46.65,50.8 46.82,50.97 JP13.2
RC3
  Top 0.25: IC10.9 39.11,42.11 42,45 45,45 46.71,46.71 JP14.2
REF  (via drill 0.35)
  Top 0.25: IC11.4 29.82,61.88 v29.8,61.9
  Bottom 0.25: v29.8,61.9 22.1,61.9 18.29,65.71 JP18.1
SCL1
  Top 0.25: IC4.12 17.91,49.91 21,53 27,53 28,54 28,56 29,57 29.8,57 | IC11.5 29.82,56.98 29.8,57 | 29.8,57 38.6,57 42.79,52.81 JP13.1
SCL2  (via drill 0.35)
  Top 0.25: 13.11,41.54 11.87,40.3 9.3,40.3 6.04,37.04 JP11.2 | 13.11,41.54 16.48,44.92 16.48,49.06 v17.1,49.68 | IC4.18 v21.81,49.69 v21.8,49.7 | IC10.6 v39.11,19.79 v39.1,19.8 | v12.6,42.05 13.11,41.54
  Bottom 0.25: v21.8,49.7 17.12,49.7 v17.1,49.68 | v39.1,19.8 36.9,22 35.07,22 32.77,24.29 32.77,27.19 31.51,28.46 26.19,28.46 v12.6,42.05
SDA1
  Top 0.25: IC11.6 30.48,53.91 29.17,52.6 28,52.6 | IC4.13 18.56,49.99 21.17,52.6 28,52.6 | 28,52.6 28,51 30.19,48.81 JP14.1
SDA2  (via drill 0.35)
  Top 0.25: IC4.6 19.86,53.29 16,49.43 16,45 13.65,42.65 10.1,42.65 | JP11.3 1.5,34.5 1,35 1,41 2.65,42.65 10.1,42.65 | IC10.5 36.57,19.87 v36.6,19.9 | 10.1,42.65 v10.1,40.9
  Bottom 0.25: v36.6,19.9 32.38,24.12 32.38,26.89 31.26,28 26,28 14,40 11,40 v10.1,40.9
TOP0
  Top 0.25: JP1.2 63.03,50.1 61.99,51.14 59.41,51.14 58.8,51.75 58.8,56.52 68.1,65.82 68.1,72.32 66.09,74.33 61.38,74.33 60.9,73.85 JP2.1
TOP1
  Top 0.25: JP4.2 58.85,50.1 58.4,50.55 58.4,56.68 67.7,65.98 67.7,72.05 66.81,72.94 JP5.1
TYPE00A
  Top 0.25: PHDA1.2 PHDA1.1 75.62,51.6 63.61,51.6 62.57,52.64 JP4.3
TYPE00B
  Top 0.25: PHDB1.A 90,50.09 90.34,49.75 97.85,49.75 98.25,49.35 98.25,48 97.25,47 90.87,47 87.72,43.85 85.73,43.85 83.98,45.6 61.75,45.6 60.8,46.55 JP4.1
TYPE01A
  Top 0.152: 81.6,48.22 PHDA2.1
  Top 0.25: JP1.3 75.16,52.64 78.2,49.6 80.85,49.6 81.5,48.95 PHDA2.1 | PHDA2.2 81.6,48.22
TYPE01B
  Top 0.25: PHDB8.A PHDB7.A PHDB2.A 92.5,51.94 91.99,52.45 89.6,52.45 88.85,51.7 88.85,45.55 87.55,44.25 85.9,44.25 84.15,46 69,46 67.44,47.56 JP1.1
TYPE10A
  Top 0.25: PHDA4.2 80,37.3 79.61,36.91 79,36.91 | 79,36.91 71.49,36.91 67.06,41.34 JP6.3 | PHDA4.1 79,36.91
TYPE10B
  Top 0.25: PHDB4.A 90,40.24 90.34,39.9 99,39.9 99.6,39.3 99.6,36.17 97.21,33.77 66.3,33.77 65.1,34.98 JP6.1
TYPE11A
  Top 0.25: PHDA3.2 82.5,39.45 82.15,39.8 81.5,39.8 | JP9.3 61.1,42.75 61.7,43.35 66.75,43.35 70.3,39.8 81.5,39.8 | PHDA3.1 81.5,39.8
TYPE11B
  Top 0.25: PHDB3.A PHDB5.A PHDB6.A 99.16,40.94 100,40.1 100,36 97.38,33.38 62.62,33.38 61.1,34.9 JP9.1
VCC
  Top 0.25: IC1.7 14.28,35.12 13.5,35.9 13.5,37.13 C16.1

### Text on the board
Top: 1 | IPD Blood Monitor / Sensor Test PCB V1_3
Bottom: 2
tPlace: GND | SCL | SDA | 3V3 | 5V
tNames: TOP | BOT | TYPE A | TYPE B | External | Internal | TYPE A | TYPE B | A | B | A | B | A | IPD Blood Monitor / Sensor Test PCB V1_3 | B
tValues: External / Reference | PWMOC | PWMUC | PIC24 | PIC16